# EAGLE design rom17 (EAGLE 6.3)
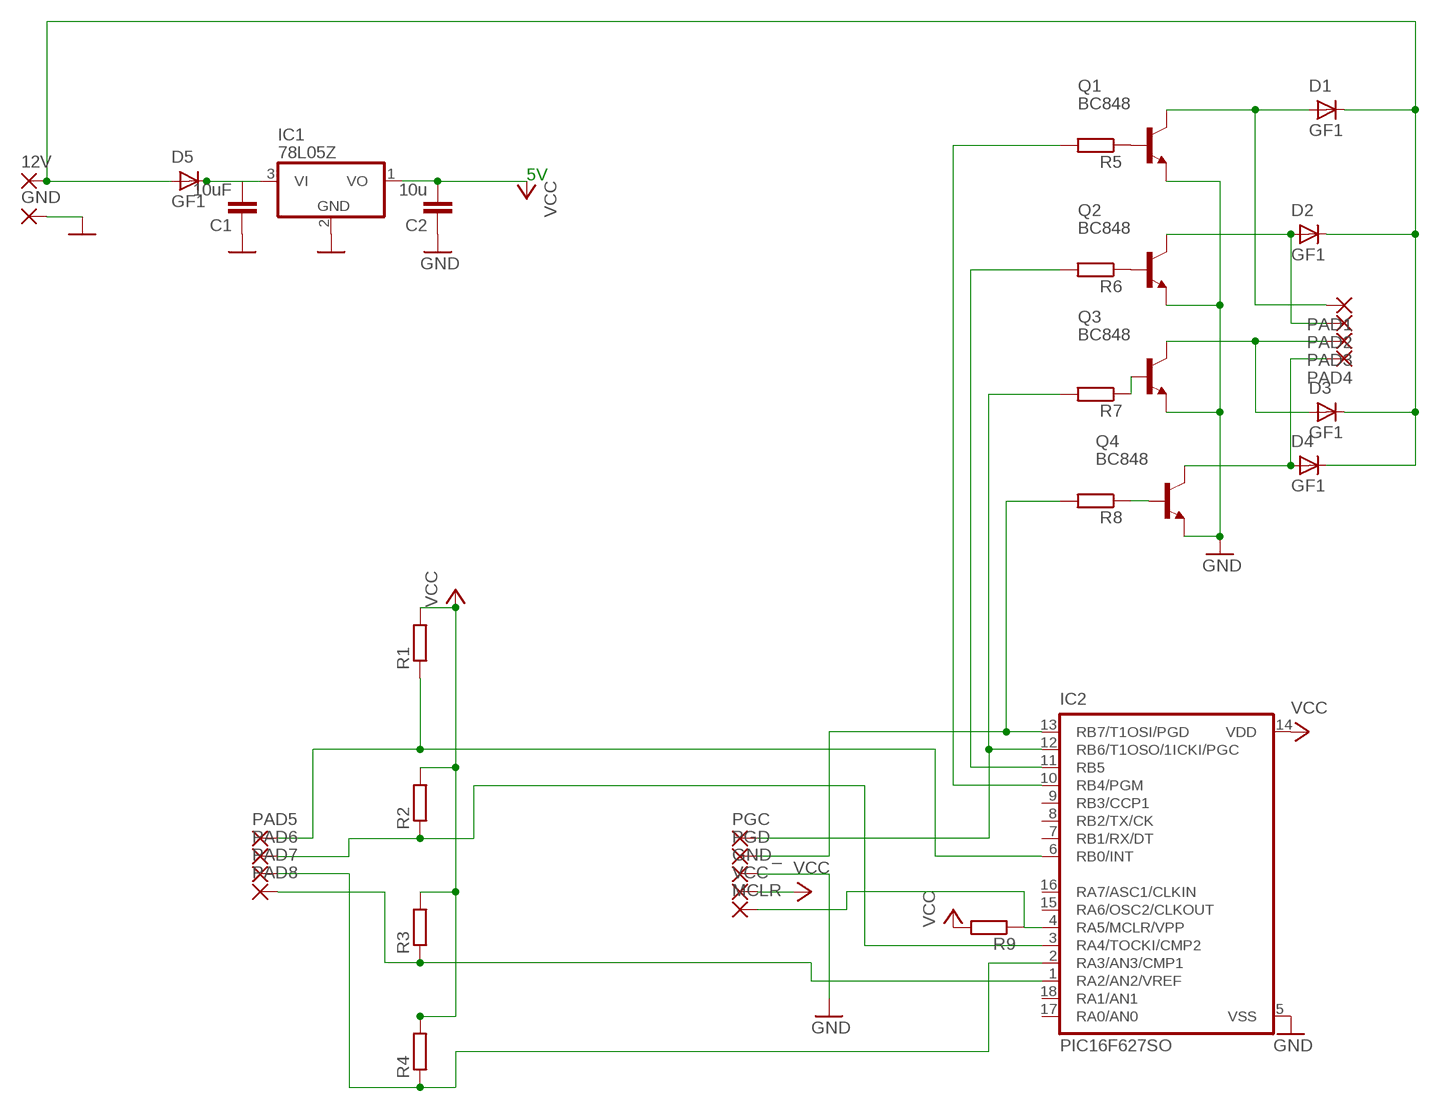
[diagram p0: schematic, sheet 1]

## Parts
12V  2,54/0,8  [2,54/0,8]
C1  10uF  C-EUC1206  [C1206]
C2  10u  C-EUC1206  [C1206]
D1  GF1  [SMA-DO214AC]
D2  GF1  [SMA-DO214AC]
D3  GF1  [SMA-DO214AC]
D4  GF1  [SMA-DO214AC]
D5  GF1  [SMA-DO214AC]
GND  2,54/0,8  [2,54/0,8]
GND_  2,15/1,0  [2,15/1,0]
IC1  78L05Z  [TO92]
IC2  PIC16F627SO  [SO-18W]
MCLR  2,15/1,0  [2,15/1,0]
PAD1  2,54/0,8  [2,54/0,8]
PAD2  2,54/0,8  [2,54/0,8]
PAD3  2,54/0,8  [2,54/0,8]
PAD4  2,54/0,8  [2,54/0,8]
PAD5  2,54/0,8  [2,54/0,8]
PAD6  2,54/0,8  [2,54/0,8]
PAD7  2,54/0,8  [2,54/0,8]
PAD8  2,54/0,8  [2,54/0,8]
PGC  2,15/1,0  [2,15/1,0]
PGD  2,15/1,0  [2,15/1,0]
Q1  BC848  [SOT23]
Q2  BC848  [SOT23]
Q3  BC848  [SOT23]
Q4  BC848  [SOT23]
R1  R-EU_M1206  [M1206]
R2  R-EU_M1206  [M1206]
R3  R-EU_M1206  [M1206]
R4  R-EU_M1206  [M1206]
R5  R-EU_M1206  [M1206]
R6  R-EU_M1206  [M1206]
R7  R-EU_M1206  [M1206]
R8  R-EU_M1206  [M1206]
R9  R-EU_M1206  [M1206]
VCC  2,15/1,0  [2,15/1,0]

## Nets
N$1: D1.A PAD1.1(P) Q1.3(C)
N$2: D2.A PAD2.1(P) Q2.3(C)
N$3: D3.A PAD3.1(P) Q3.3(C)
N$4: IC2.3(RA4/TOCKI/CMP2) PAD6.1(P) R2.1
N$5: D4.A PAD4.1(P) Q4.3(C)
N$6: Q1.1(B) R5.1
N$7: IC2.10(RB4/PGM) R5.2
N$8: IC2.11(RB5) R6.2
N$9: IC2.12(RB6/T1OSO/1ICKI/PGC) PGC.1(P) R7.2
N$10: IC2.2(RA3/AN3/CMP1) PAD7.1(P) R4.1
N$11: 12V.1(P) D1.K(C) D2.K(C) D3.K(C) D4.K(C) D5.A
N$12: Q2.1(B) R6.1
N$13: Q3.1(B) R7.1
N$14: IC2.13(RB7/T1OSI/PGD) PGD.1(P) R8.2
N$15: Q4.1(B) R8.1
N$16: IC2.4(RA5/MCLR/VPP) MCLR.1(P) R9.1
N$22: C1.2 D5.K(C) IC1.3(VI)
N$46: C1.1 C2.1 GND.1(P) GND_.1(P) IC1.2(GND) IC2.5(VSS) Q1.2(E) Q2.2(E) Q3.2(E) Q4.2(E) ; supply symbol labelled GND
N$48: IC2.1(RA2/AN2/VREF) PAD8.1(P) R3.1
R5: IC2.6(RB0/INT) PAD5.1(P) R1.1
VCC: C2.2 IC1.1(VO) IC2.14(VDD) R1.2 R2.2 R3.2 R4.2 R9.2 VCC.1(P)
Unconnected: IC2.7(RB1/RX/DT) IC2.8(RB2/TX/CK) IC2.9(RB3/CCP1) IC2.15(RA6/OSC2/CLKOUT) IC2.16(RA7/ASC1/CLKIN) IC2.17(RA0/AN0) IC2.18(RA1/AN1)

## Notes on the sheet
- 5V

## Library data of the parts
12V GND PAD1-PAD8 = wirepad:2,54/0,8: THROUGH-HOLE PAD
C1 C2 = resistor:C-EU: CAPACITOR, European symbol
D1-D5 = diode:GF1: DIODE
GND_ MCLR PGC PGD VCC = wirepad:2,15/1,0: THROUGH-HOLE PAD
IC1 = linear:78*: Positive VOLTAGE REGULATOR Source: http://cache.national.com/ds/LM/LM78L05.pdf http://www.fairchildsemi.com/ds/LM/LM7805.pdf
IC2 = microchip:PIC16*F62: FLASH-Based 8-Bit CMOS Microcontroller Source: http://ww1.microchip.com/downloads/en/DeviceDoc/40300C.pdf; MF: MICROCHIP; MPN: PIC16F627-04/SO; OC_FARNELL: 1084265; OC_NEWARK: 69K7632
Q1-Q4 = transistor:BC848: NPN TRANSISTOR
R1-R9 = resistor:R-EU_: RESISTOR, European symbol

## Net classes
0 default: clearance 0.355 mm

## Board
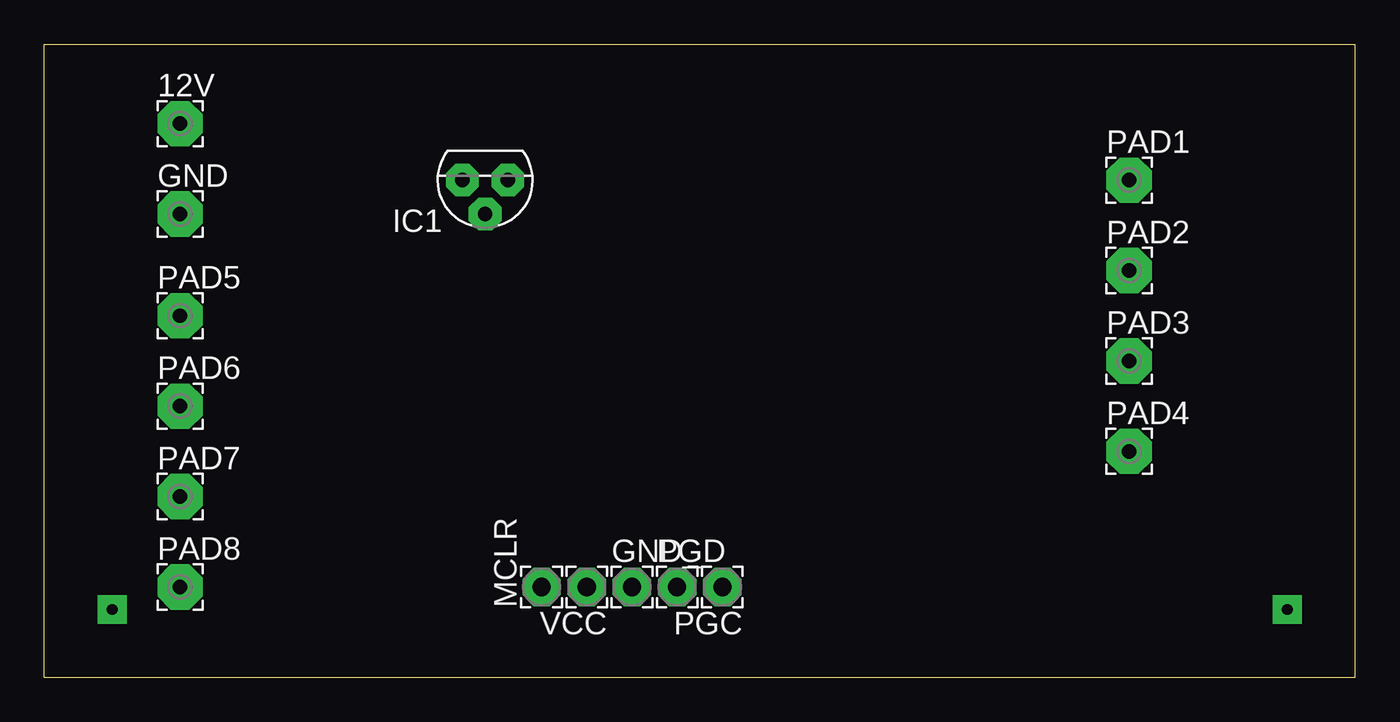
[diagram p1: board, top side]
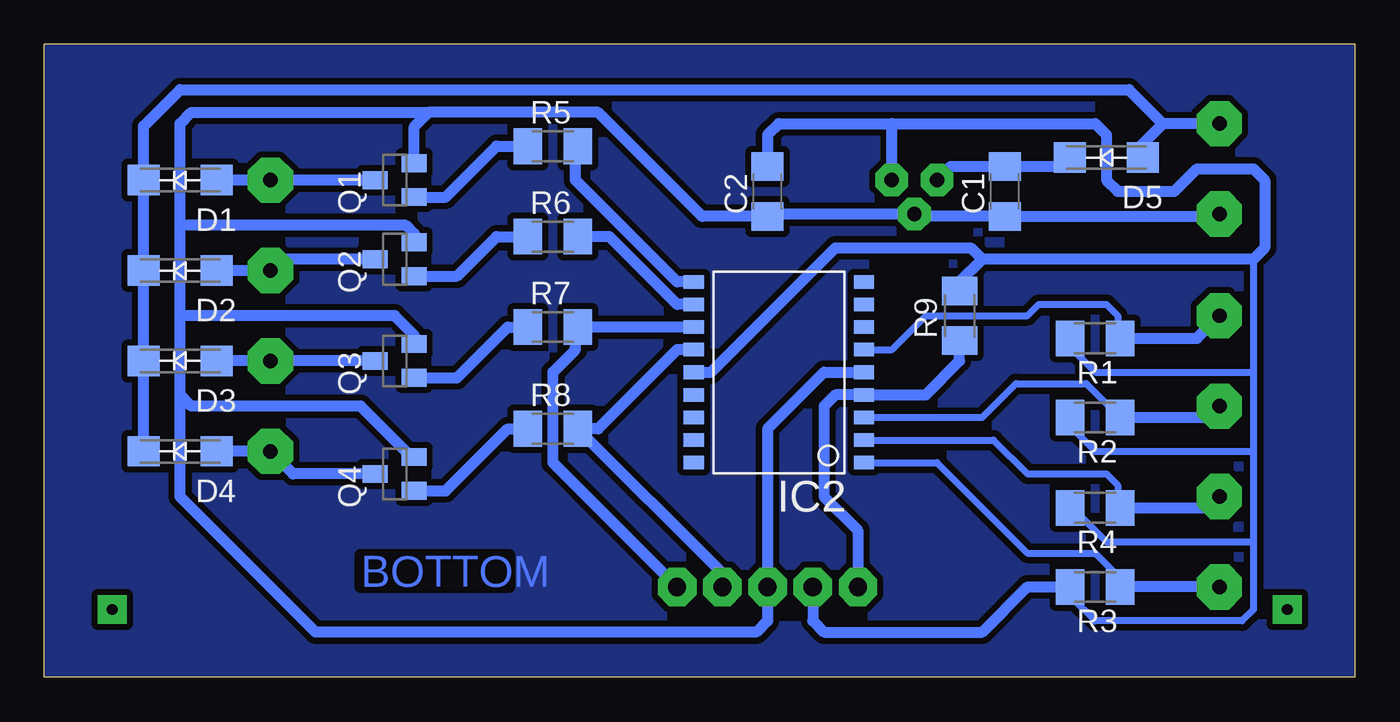
[diagram p2: board, bottom side, seen from below]

Size 73.66 x 35.56 mm. Coordinates in mm from the lower left corner, seen from the top.
Outline: 0,0 73.66,0 73.66,35.56 0,35.56 0,0
Copper layers (1*16): Top 0.035mm / dielectric 1.5mm / Bottom 0.035mm
Design rules "default *": minimum track width 10mil, minimum drill 24mil, track to track 8mil, track to pad 8mil, pad to pad 8mil, via to via 8mil, smd to smd 8mil, copper to edge 1mil, drill to drill 8mil, minimum pad ring 25mil, minimum via ring 25mil, stop-mask expansion 4mil, vias tented up to drill 0mil, thermal gap 10mil
bRestrict: area 8.3,27.9 to 11.4,30.5; area 5.7,24.1 to 7.6,27.9; area 7.6,24.1 to 19.7,26; area 14,26 to 25.4,30.5; area 12.1,30.5 to 14.6,32.4; area 6.3,12.7 to 14,19.1; area 7,3.8 to 13.3,12.7; area 22.9,16.5 to 27.3,23.5; area 61.6,12.7 to 67.9,27.9; area 66,28.6 to 67.3,31.1; area 27.9,3.2 to 37.5,4.4

### Footprints (pad centres in the part's own frame; a part is rotated, then mirrored left to right if it is on the bottom)
2,54/0,8 = drill 0.813 pad 2.54 octagon: 1 0,0
C1206 = smd 1.6 x 1.8: 1 -1.4,0; 2 1.4,0
SMA-DO214AC = smd 1.8 x 1.7: A -2.05,0; K 2.05,0
2,15/1,0 = drill 1.016 pad 2.159 octagon: 1 0,0
TO92 = drill 0.813 octagon: 1 -1.27,0; 2 0,1.905; 3 1.27,0
SO-18W = smd 0.762 x 1.143: 1 -5.08,-4.788; 2 -3.81,-4.788; 3 -2.54,-4.788; 4 -1.27,-4.788; 5 0,-4.788; 6 1.27,-4.788; 7 2.54,-4.788; 8 3.81,-4.788; 9 5.08,-4.788; 10 5.08,4.788; 11 3.81,4.788; 12 2.54,4.788; 13 1.27,4.788; 14 0,4.788; 15 -1.27,4.788; 16 -2.54,4.788; 17 -3.81,4.788; 18 -5.08,4.788
SOT23 = smd 1 x 1.4: 1 -0.95,-1.1; 2 0.95,-1.1; 3 0,1.1
M1206 = smd 1.6 x 2: 1 -1.4,0; 2 1.4,0

### Placement (x,y rotation side)
12V  7.62,31.11 0 top
C1  19.68,27.3 90 bottom
C2  33.02,27.3 90 bottom
D1  66.04,27.94 180 bottom
D2  66.04,22.86 180 bottom
D3  66.04,17.78 180 bottom
D4  66.04,12.7 180 bottom
D5  13.97,29.21 180 bottom
GND  7.62,26.04 0 top
GND_  33.02,5.08 0 top
IC1  24.77,27.94 180 top
IC2  32.38,17.14 90 bottom
MCLR  27.94,5.08 90 top
PAD1  60.96,27.94 0 top
PAD2  60.96,22.86 0 top
PAD3  60.96,17.78 0 top
PAD4  60.96,12.7 0 top
PAD5  7.62,20.32 0 top
PAD6  7.62,15.24 0 top
PAD7  7.62,10.16 0 top
PAD8  7.62,5.08 0 top
PGC  38.1,5.08 180 top
PGD  35.56,5.08 0 top
Q1  53.98,27.94 90 bottom
Q2  53.98,23.5 90 bottom
Q3  53.98,17.78 90 bottom
Q4  53.98,11.43 90 bottom
R1  14.61,19.05 180 bottom
R2  14.61,14.61 180 bottom
R3  14.61,5.08 180 bottom
R4  14.61,9.53 180 bottom
R5  45.09,29.84 0 bottom
R6  45.09,24.77 0 bottom
R7  45.09,19.68 0 bottom
R8  45.09,13.97 0 bottom
R9  22.23,20.32 90 bottom
VCC  30.48,5.08 180 top

### Tracks (layer width: path | path; a pad name or v marks a point on that pad's centre or on a via)
GND
  pour Bottom: 0,35.56 73.66,35.56 73.66,0 0,0
N$1
  Bottom 0.61: D1.A PAD1.1 Q1.3
N$2
  Bottom 0.61: Q2.3 60.33,23.5 PAD2.1 D2.A
N$3
  Bottom 0.61: Q3.3 PAD3.1 D3.A
N$4
  Bottom 0.406: IC2.3 20.95,14.61 19.05,16.51 15.11,16.51 R2.1
  Bottom 0.61: R2.1 8.26,14.61 PAD6.1
N$5
  Bottom 0.61: Q4.3 59.69,11.43 PAD4.1 D4.A
N$6
  Bottom 0.61: Q1.1 51.12,26.99 48.26,29.84 R5.1
N$7
  Bottom 0.61: IC2.10 38.1,22.23 43.81,27.94 43.81,29.71 R5.2
N$8
  Bottom 0.61: IC2.11 38.1,20.95 41.91,24.77 R6.2
N$9
  Bottom 0.61: IC2.12 R7.2 43.81,19.55 43.81,18.41 45.09,17.14 45.09,12.06 PGC.1
N$10
  Bottom 0.406: IC2.2 20.32,13.34 18.41,11.43 13.97,11.43 13.34,10.79 13.34,9.65 R4.1
  Bottom 0.61: R4.1 8.26,9.53 PAD7.1
N$11
  Bottom 0.61: D4.K D3.K D2.K D1.K 68.09,30.97 66.04,33.02 12.7,33.02 10.79,31.11 | 12V.1 10.79,31.11 | 10.79,31.11 12.06,29.84 12.06,28.72 D5.A
N$12
  Bottom 0.61: Q2.1 50.48,22.55 48.26,24.77 R6.1
N$13
  Bottom 0.61: R7.1 47.62,19.68 50.48,16.83 Q3.1
N$14
  Bottom 0.61: IC2.13 38.1,18.41 42.55,13.97 R8.2 35.56,5.84 PGD.1
N$15
  Bottom 0.61: Q4.1 51.12,10.48 47.62,13.97 R8.1
N$16
  Bottom 0.61: MCLR.1 27.94,8.26 29.84,10.16 29.84,15.24 29.21,15.88 IC2.4 24.13,15.88 22.23,17.78 R9.1
N$22
  Bottom 0.254: 15.24,29.21 D5.K
  Bottom 0.61: IC1.3 22.73,28.7 C1.2 16.15,28.7 D5.K
N$46
  Bottom 0.61: IC1.2 32.89,26.04 C2.1 36.7,25.91 42.55,31.75 52.07,31.75 | IC2.5 29.84,17.14 33.02,13.97 GND_.1 33.02,3.17 33.66,2.54 58.42,2.54 66.04,10.16 66.04,15.88 | 24.77,25.91 IC1.2 | IC1.2 24.64,25.91 C1.1 7.75,25.91 GND.1 | Q4.2 53.02,12.38 55.88,15.24 65.41,15.24 66.04,15.88 | 66.04,15.88 66.04,20.32 | 66.04,20.32 66.04,25.4 | 66.04,25.4 66.04,31.11 65.41,31.75 52.07,31.75 | Q2.2 52.88,24.93 53.34,25.4 66.04,25.4 | Q3.2 52.88,19.22 53.98,20.32 66.04,20.32 | Q1.2 52.88,30.95 52.07,31.75
N$48
  Bottom 0.406: IC2.1 23.5,12.06 18.41,6.99 14.61,6.99 13.34,5.71 13.34,5.21 R3.1
  Bottom 0.61: PAD8.1 R3.1
N$58  (via drill 0.6)
  other vias: 3.81,3.81
N$59  (via drill 0.6)
  other vias: 69.85,3.81
R5
  Bottom 0.406: IC2.6 26.04,18.41 24.13,20.32 18.41,20.32 17.78,20.95 13.97,20.95 13.34,20.32 13.34,19.18 R1.1
  Bottom 0.61: R1.1 8.89,19.05 PAD5.1
VCC
  Bottom 0.406: R1.2 16,18.55 14.61,17.14 5.71,17.14 | 5.71,23.5 5.71,17.14 | 5.71,17.14 5.71,12.7 | 5.71,12.7 5.71,7.62 | 5.71,7.62 5.71,3.81 6.35,3.17 14.61,3.17 15.88,4.45 15.88,4.95 R3.2 | R4.2 15.88,9.53 13.97,7.62 5.71,7.62 | R2.2 16,14.1 14.61,12.7 5.71,12.7
  Bottom 0.61: 15.88,19.18 R1.2 | 26.04,31.11 32.38,31.11 33.02,30.48 C2.2 | 26.04,31.11 14.61,31.11 13.97,30.48 13.97,27.94 13.34,27.3 10.16,27.3 8.89,28.57 5.71,28.57 5.08,27.94 5.08,24.13 5.71,23.5 20.95,23.5 | 20.95,23.5 22.23,22.23 R9.2 | VCC.1 30.48,3.17 29.84,2.54 20.95,2.54 18.41,5.08 R3.2 | IC2.14 36.2,17.14 29.21,24.13 21.59,24.13 20.95,23.5 | IC1.1 26.04,31.11

### Text on the board
Bottom: BOTTOM